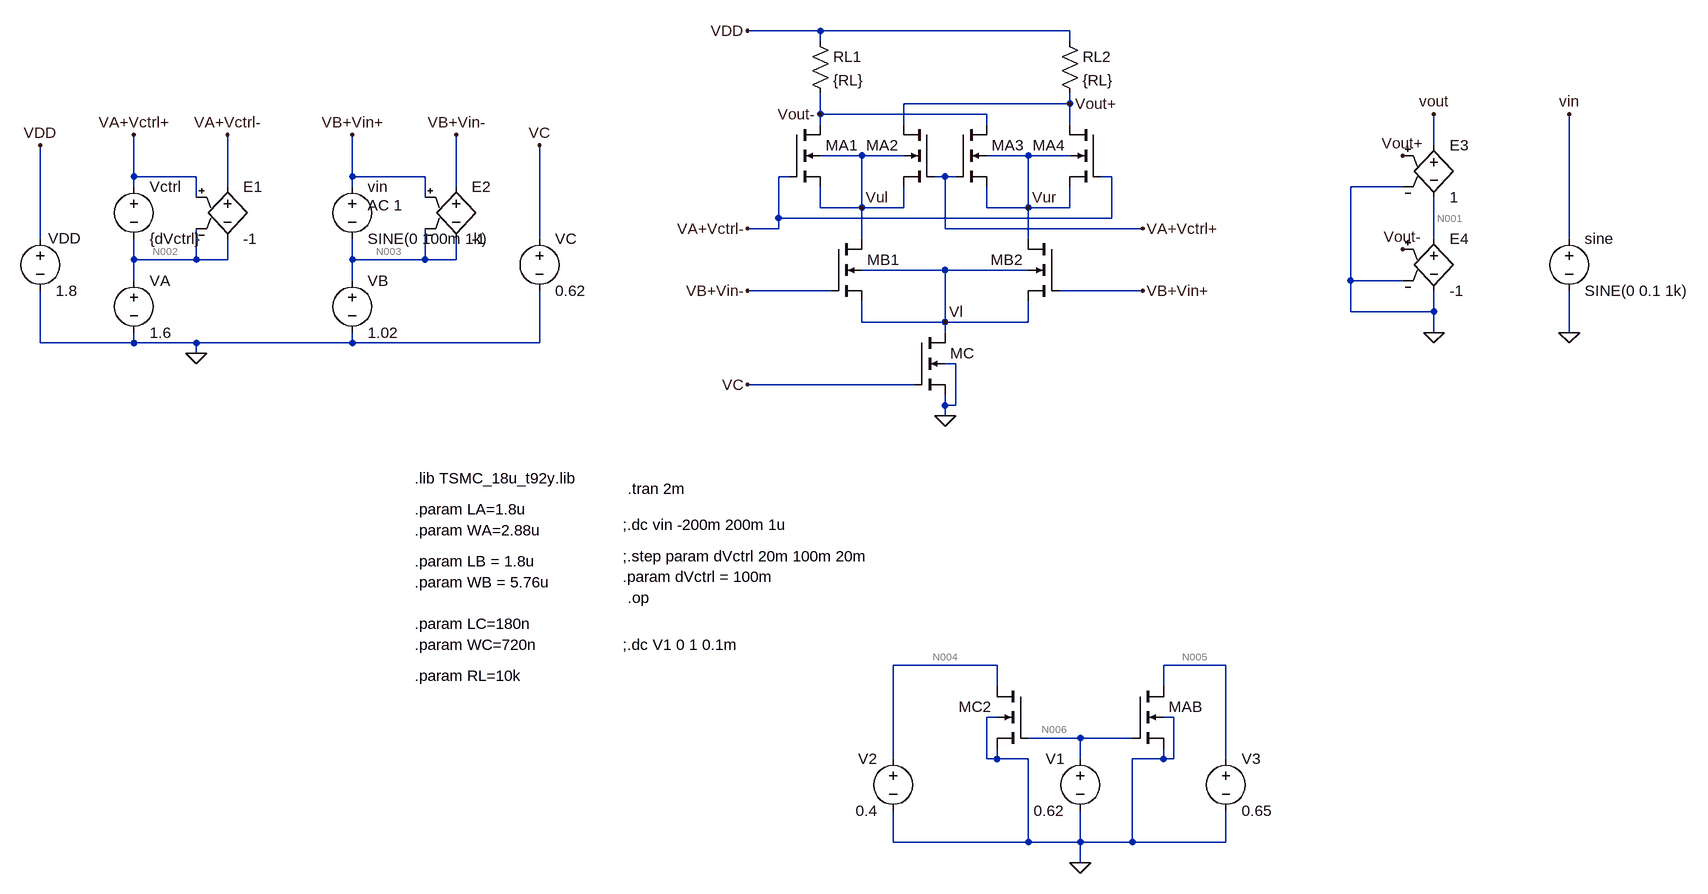
[diagram p0: schematic TSMC182n.asc]
TSMC182n.asc, the LTspice schematic file:
Version 4
SHEET 1 1972 968
WIRE 576 -352 464 -352
WIRE 960 -352 576 -352
WIRE 576 -336 576 -352
WIRE 960 -336 960 -352
WIRE 960 -240 960 -256
WIRE 960 -240 704 -240
WIRE 576 -224 576 -256
WIRE 832 -224 576 -224
WIRE 576 -208 576 -224
WIRE 704 -208 704 -240
WIRE 832 -208 832 -224
WIRE 960 -208 960 -240
WIRE 1520 -176 1520 -224
WIRE 640 -160 576 -160
WIRE 704 -160 640 -160
WIRE 896 -160 832 -160
WIRE 960 -160 896 -160
WIRE -480 -128 -480 -192
WIRE -384 -128 -480 -128
WIRE -144 -128 -144 -192
WIRE -32 -128 -144 -128
WIRE 528 -128 512 -128
WIRE 768 -128 752 -128
WIRE 784 -128 768 -128
WIRE 1024 -128 1008 -128
WIRE -480 -112 -480 -128
WIRE -336 -112 -336 -192
WIRE -144 -112 -144 -128
WIRE 16 -112 16 -192
WIRE 1472 -112 1392 -112
WIRE -384 -96 -384 -128
WIRE -32 -96 -32 -128
WIRE 576 -80 576 -112
WIRE 640 -80 640 -160
WIRE 640 -80 576 -80
WIRE 704 -80 704 -112
WIRE 704 -80 640 -80
WIRE 832 -80 832 -112
WIRE 896 -80 896 -160
WIRE 896 -80 832 -80
WIRE 960 -80 960 -112
WIRE 960 -80 896 -80
WIRE 512 -64 512 -128
WIRE 1024 -64 1024 -128
WIRE 1024 -64 512 -64
WIRE 512 -48 512 -64
WIRE 512 -48 464 -48
WIRE 768 -48 768 -128
WIRE 1072 -48 768 -48
WIRE -624 -32 -624 -176
WIRE 144 -32 144 -176
WIRE 640 -32 640 -80
WIRE 896 -32 896 -80
WIRE 1520 -32 1520 -96
WIRE 1728 -32 1728 -224
WIRE -480 0 -480 -32
WIRE -384 0 -384 -48
WIRE -384 0 -480 0
WIRE -336 0 -336 -32
WIRE -336 0 -384 0
WIRE -144 0 -144 -32
WIRE -32 0 -32 -48
WIRE -32 0 -144 0
WIRE 16 0 16 -32
WIRE 16 0 -32 0
WIRE 768 16 640 16
WIRE 896 16 768 16
WIRE -480 32 -480 0
WIRE -144 32 -144 0
WIRE 1392 32 1392 -112
WIRE 1472 32 1392 32
WIRE 592 48 464 48
WIRE 1072 48 944 48
WIRE 1392 80 1392 32
WIRE 1520 80 1520 48
WIRE 1520 80 1392 80
WIRE 640 96 640 64
WIRE 768 96 768 16
WIRE 768 96 640 96
WIRE 896 96 896 64
WIRE 896 96 768 96
WIRE 768 112 768 96
WIRE 1520 112 1520 80
WIRE 1728 112 1728 48
WIRE -624 128 -624 48
WIRE -480 128 -480 112
WIRE -480 128 -624 128
WIRE -384 128 -480 128
WIRE -144 128 -144 112
WIRE -144 128 -384 128
WIRE 144 128 144 48
WIRE 144 128 -144 128
WIRE -384 144 -384 128
WIRE 784 160 768 160
WIRE 720 192 464 192
WIRE 768 224 768 208
WIRE 784 224 784 160
WIRE 784 224 768 224
WIRE 768 240 768 224
WIRE 848 624 688 624
WIRE 1200 624 1104 624
WIRE 848 656 848 624
WIRE 1104 656 1104 624
WIRE 848 704 832 704
WIRE 1120 704 1104 704
WIRE 976 736 896 736
WIRE 1056 736 976 736
WIRE 688 768 688 624
WIRE 832 768 832 704
WIRE 848 768 848 752
WIRE 848 768 832 768
WIRE 896 768 848 768
WIRE 976 768 976 736
WIRE 1104 768 1104 752
WIRE 1104 768 1056 768
WIRE 1120 768 1120 704
WIRE 1120 768 1104 768
WIRE 1200 768 1200 624
WIRE 688 896 688 848
WIRE 896 896 896 768
WIRE 896 896 688 896
WIRE 976 896 976 848
WIRE 976 896 896 896
WIRE 1056 896 1056 768
WIRE 1056 896 976 896
WIRE 1200 896 1200 848
WIRE 1200 896 1056 896
WIRE 976 928 976 896
FLAG -624 -176 VDD
FLAG 144 -176 VC
FLAG -384 144 0
FLAG 768 240 0
FLAG 464 -352 VDD
FLAG 464 192 VC
FLAG 576 -224 Vout-
FLAG 960 -240 Vout+
FLAG 640 -80 Vul
FLAG 896 -80 Vur
FLAG 768 96 Vl
FLAG 464 -48 VA+Vctrl-
FLAG -336 -192 VA+Vctrl-
FLAG 1072 -48 VA+Vctrl+
FLAG -480 -192 VA+Vctrl+
FLAG -144 -192 VB+Vin+
FLAG 1072 48 VB+Vin+
FLAG 16 -192 VB+Vin-
FLAG 464 48 VB+Vin-
FLAG 976 928 0
FLAG 1520 112 0
FLAG 1472 -160 Vout+
FLAG 1472 -16 Vout-
FLAG 1520 -224 vout
FLAG 1728 112 0
FLAG 1728 -224 vin
DATAFLAG 672 96 ""
DATAFLAG 576 -80 ""
DATAFLAG 672 -224 ""
SYMBOL voltage -624 -48 R0
WINDOW 0 12 15 Left 2
SYMATTR InstName VDD
SYMATTR Value 1.8
SYMBOL voltage -480 16 R0
WINDOW 123 0 0 Left 0
WINDOW 39 0 0 Left 0
SYMATTR InstName VA
SYMATTR Value 1.6
SYMBOL voltage -144 16 R0
WINDOW 123 0 0 Left 0
WINDOW 39 0 0 Left 0
SYMATTR InstName VB
SYMATTR Value 1.02
SYMBOL res 560 -352 R0
SYMATTR InstName RL1
SYMATTR Value {RL}
SYMBOL res 944 -352 R0
SYMATTR InstName RL2
SYMATTR Value {RL}
SYMBOL nmos4 528 -208 R0
WINDOW 3 62 71 Invisible 2
SYMATTR Value NMOS_op
SYMATTR InstName MA1
SYMATTR Value2 l={LA} w={WA}
SYMBOL nmos4 752 -208 M0
WINDOW 3 -144 80 Invisible 2
SYMATTR Value NMOS_op
SYMATTR InstName MA2
SYMATTR Value2 l={LA} w={WA}
SYMBOL nmos4 784 -208 R0
WINDOW 3 62 71 Invisible 2
SYMATTR Value NMOS_op
SYMATTR InstName MA3
SYMATTR Value2 l={LA} w={WA}
SYMBOL nmos4 1008 -208 M0
WINDOW 3 -144 80 Invisible 2
SYMATTR Value NMOS_op
SYMATTR InstName MA4
SYMATTR Value2 l={LA} w={WA}
SYMBOL nmos4 592 -32 R0
WINDOW 3 61 72 Invisible 2
SYMATTR Value NMOS_op
SYMATTR InstName MB1
SYMATTR Value2 l={LB} w={WB}
SYMBOL nmos4 944 -32 M0
WINDOW 3 56 72 Invisible 2
SYMATTR Value NMOS_op
SYMATTR InstName MB2
SYMATTR Value2 l={LB} w={WB}
SYMBOL nmos4 720 112 R0
WINDOW 3 56 72 Invisible 2
SYMATTR Value NMOS_op
SYMATTR InstName MC
SYMATTR Value2 l={LC} w={WC}
SYMBOL voltage 144 -48 R0
WINDOW 123 0 0 Left 0
WINDOW 39 0 0 Left 0
SYMATTR InstName VC
SYMATTR Value 0.62
SYMBOL nmos4 896 656 M0
WINDOW 3 56 72 Invisible 2
SYMATTR Value NMOS_op
SYMATTR InstName MC2
SYMATTR Value2 l=7.2u w=36.72u
SYMBOL voltage 976 752 M0
WINDOW 123 0 0 Left 0
WINDOW 39 0 0 Left 0
SYMATTR InstName V1
SYMATTR Value 0.62
SYMBOL voltage 688 752 M0
WINDOW 123 0 0 Left 0
WINDOW 39 0 0 Left 0
SYMATTR InstName V2
SYMATTR Value 0.4
SYMBOL voltage -480 -128 R0
WINDOW 123 0 0 Left 0
WINDOW 39 0 0 Left 0
SYMATTR InstName Vctrl
SYMATTR Value {dVctrl}
SYMBOL voltage -144 -128 R0
WINDOW 123 24 44 Left 2
WINDOW 39 0 0 Left 0
SYMATTR Value2 AC 1
SYMATTR InstName vin
SYMATTR Value SINE(0 100m 1k)
SYMBOL e -336 -128 R0
SYMATTR InstName E1
SYMATTR Value -1
SYMBOL e 16 -128 R0
SYMATTR InstName E2
SYMATTR Value -1
SYMBOL nmos4 1056 656 R0
WINDOW 3 56 72 Invisible 2
SYMATTR Value NMOS_op
SYMATTR InstName MAB
SYMATTR Value2 l=1.8u w=2.88u
SYMBOL voltage 1200 752 R0
WINDOW 123 0 0 Left 0
WINDOW 39 0 0 Left 0
SYMATTR InstName V3
SYMATTR Value 0.65
SYMBOL e 1520 -192 R0
SYMATTR InstName E3
SYMATTR Value 1
SYMBOL e 1520 -48 R0
SYMATTR InstName E4
SYMATTR Value -1
SYMBOL voltage 1728 -48 R0
WINDOW 123 0 0 Left 0
WINDOW 39 0 0 Left 0
SYMATTR InstName sine
SYMATTR Value SINE(0 0.1 1k)
TEXT -48 336 Left 2 !.lib TSMC_18u_t92y.lib
TEXT 272 408 Left 2 !;.dc vin -200m 200m 1u
TEXT -48 384 Left 2 !.param LA=1.8u
TEXT -48 416 Left 2 !.param WA=2.88u
TEXT -48 560 Left 2 !.param LC=180n
TEXT -48 592 Left 2 !.param WC=720n
TEXT -48 640 Left 2 !.param RL=10k
TEXT 272 456 Left 2 !;.step param dVctrl 20m 100m 20m
TEXT 280 520 Left 2 !.op
TEXT 272 592 Left 2 !;.dc V1 0 1 0.1m
TEXT 280 352 Left 2 !.tran 2m
TEXT -48 464 Left 2 !.param LB = 1.8u
TEXT -48 496 Left 2 !.param WB = 5.76u
TEXT 272 488 Left 2 !.param dVctrl = 100m

The netlist it stands for:
* TSMC182n.asc
VDD VDD 0 1.8
VA N002 0 1.6
VB N003 0 1.02
RL1 VDD Vout- {RL}
RL2 VDD Vout+ {RL}
MA1 Vout- VA+Vctrl- Vul Vul NMOS_op l={LA} w={WA}
MA2 Vout+ VA+Vctrl+ Vul Vul NMOS_op l={LA} w={WA}
MA3 Vout- VA+Vctrl+ Vur Vur NMOS_op l={LA} w={WA}
MA4 Vout+ VA+Vctrl- Vur Vur NMOS_op l={LA} w={WA}
MB1 Vul VB+Vin- Vl Vl NMOS_op l={LB} w={WB}
MB2 Vur VB+Vin+ Vl Vl NMOS_op l={LB} w={WB}
MC Vl VC 0 0 NMOS_op l={LC} w={WC}
VC VC 0 0.62
MC2 N004 N006 0 0 NMOS_op l=7.2u w=36.72u
V1 N006 0 0.62
V2 N004 0 0.4
Vctrl VA+Vctrl+ N002 {dVctrl}
vin VB+Vin+ N003 SINE(0 100m 1k) AC 1
E1 VA+Vctrl- N002 VA+Vctrl+ N002 -1
E2 VB+Vin- N003 VB+Vin+ N003 -1
MAB N005 N006 0 0 NMOS_op l=1.8u w=2.88u
V3 N005 0 0.65
E3 vout N001 Vout+ 0 1
E4 N001 0 Vout- 0 -1
V§sine vin 0 SINE(0 0.1 1k)
.model NMOS NMOS
.model PMOS PMOS
.lib standard.mos
.lib TSMC_18u_t92y.lib
;.dc vin -200m 200m 1u
.param LA=1.8u
.param WA=2.88u
.param LC=180n
.param WC=720n
.param RL=10k
;.step param dVctrl 20m 100m 20m
.op
;.dc V1 0 1 0.1m
.tran 2m
.param LB = 1.8u
.param WB = 5.76u
.param dVctrl = 100m
.backanno
.end

* Results of the author's LTspice run, read from the files saved beside the schematic
* Operating Point, zero values left out:
*   V(vdd) = 1.8 V
*   V(n002) = 1.6 V
*   V(n003) = 1.02 V
*   V(vout-) = 1.699 V
*   V(vout+) = 1.699 V
*   V(va+vctrl-) = 1.5 V
*   V(vul) = 1.071 V
*   V(va+vctrl+) = 1.7 V
*   V(vur) = 1.071 V
*   V(vb+vin-) = 1.02 V
*   V(vl) = 454.2 mV
*   V(vb+vin+) = 1.02 V
*   V(vc) = 620 mV
*   V(n004) = 400 mV
*   V(n006) = 620 mV
*   V(n005) = 650 mV
*   V(n001) = -1.699 V
*   Id(Mab) = 8.864 µA
*   Is(Mab) = -8.864 µA
*   Id(Mc2) = 32.34 µA
*   Is(Mc2) = -32.34 µA
*   Id(Mc) = 20.28 µA
*   Is(Mc) = -20.28 µA
*   Id(Mb2) = 10.14 µA
*   Is(Mb2) = -10.14 µA
*   Id(Mb1) = 10.14 µA
*   Is(Mb1) = -10.14 µA
*   Id(Ma4) = 546.7 nA
*   Is(Ma4) = -546.7 nA
*   Id(Ma3) = 9.592 µA
*   Is(Ma3) = -9.592 µA
*   Id(Ma2) = 9.592 µA
*   Is(Ma2) = -9.592 µA
*   Id(Ma1) = 546.7 nA
*   Is(Ma1) = -546.7 nA
*   I(Rl2) = 10.14 µA
*   I(Rl1) = 10.14 µA
*   I(V3) = -8.864 µA
*   I(V2) = -32.34 µA
*   I(Vdd) = -20.28 µA
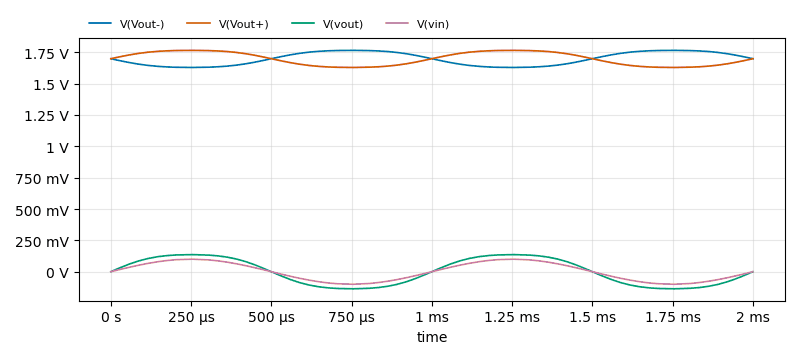
[diagram p1: Transient Analysis of TSMC182n.asc, plotted from the saved traces]
* Transient Analysis, 1 run:
*   V(Vout-): min 1.629 V, max 1.765 V, average 1.698 V, rms 1.699 V, last 1.699 V
*   V(Vout+): min 1.629 V, max 1.765 V, average 1.698 V, rms 1.699 V, last 1.699 V
*   V(vout): min -136.3 mV, max 136.4 mV, average -5.149 µV, rms 103.4 mV, last -988.2 nV
*   V(vin): min -99.93 mV, max 99.95 mV, average -3.064 µV, rms 70.52 mV, last 0 V